# EAGLE schematic Receiver Schematics (EAGLE 9.6.2)
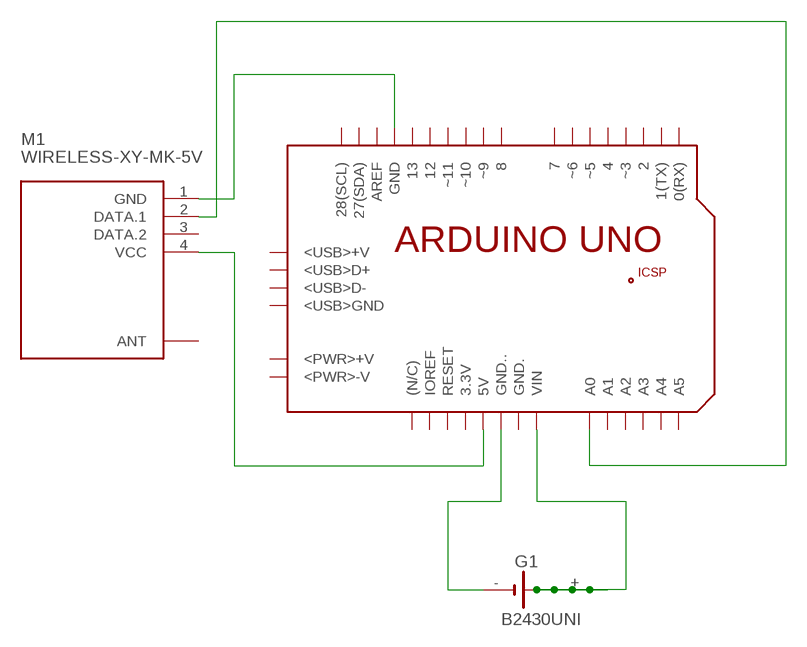
[diagram p0: schematic, sheet 1]

## Parts
G1  B2430UNI  [B2430UNI]
M1  WIRELESS-XY-MK-5V  [WIRELESS-XY-MK-5V]
PCB1  ARDUINO_UNO_EXT  (no package)

## Nets
N$1: G1.- PCB1.GND..
N$2: G1.+ G1.+@1(+) G1.+@2(+) G1.+@3(+) G1.+@4(+) PCB1.VIN
N$3: M1.1(GND) PCB1.GND
N$4: M1.4(VCC) PCB1.5V
N$5: M1.2(DATA.1) PCB1.A0
Unconnected: G1.-@1(-) M1.3(DATA.2) M1.ANT PCB1.0(RX) PCB1.1(TX) PCB1.2 PCB1.3.3V PCB1.4 PCB1.7 PCB1.8 PCB1.12 PCB1.13 PCB1.27(SDA) PCB1.28(SCL) PCB1.(N/C) PCB1.+5V PCB1.<PWR>+V PCB1.<PWR>-V PCB1.<USB>+V PCB1.<USB>D+ PCB1.<USB>D- PCB1.<USB>GND PCB1.A1 PCB1.A2 PCB1.A3 PCB1.A4 PCB1.A5 PCB1.AREF PCB1.GND. PCB1.GND_ PCB1.IOREF PCB1.MISO PCB1.MOSI PCB1.RESET PCB1.RESET. PCB1.SCK PCB1.~3 PCB1.~5 PCB1.~6 PCB1.~9 PCB1.~10 PCB1.~11

## Library data of the parts
G1 = battery:B2430UNI: LI BATTERY
M1 = diy-modules:WIRELESS-XY-MK-5V: RF Wireless XY-MK-5V Receiver Click here to find device on ebay.com <http://www.ebay.com/sch/xd+rf+5v-receiver> Note: Sold together with transmitter.
PCB1 = E14_Arduino_revC:ARDUINO_UNO_EXT: Device for representing an Arduino Uno board in an EAGLE design without the PCB footprint. Created by Dave Young for Element14. More EAGLE documentation at: http://www.element14.com/community/community/knode/cadsoft_eagle